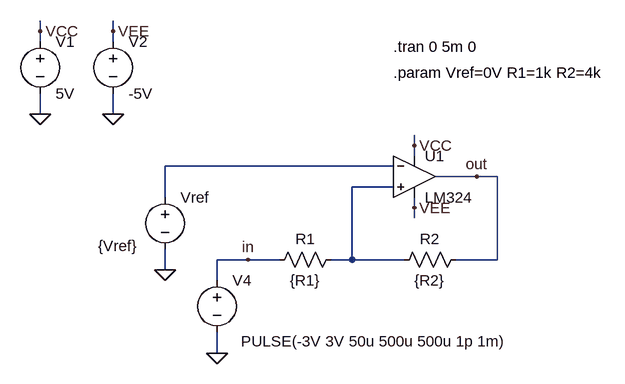
[diagram p0: schematic trigger-Schmitt-neinv.asc]
trigger-Schmitt-neinv.asc, the LTspice schematic file:
Version 4
SHEET 1 880 680
WIRE -704 -336 -704 -352
WIRE -592 -336 -592 -352
WIRE -704 -320 -704 -336
WIRE -592 -320 -592 -336
WIRE -704 -208 -704 -240
WIRE -592 -208 -592 -240
WIRE -128 -160 -128 -176
WIRE -128 -144 -128 -160
WIRE -160 -128 -512 -128
WIRE -32 -112 -96 -112
WIRE 0 -112 -32 -112
WIRE -160 -96 -224 -96
WIRE -512 -80 -512 -128
WIRE -128 -64 -128 -80
WIRE -128 -48 -128 -64
WIRE -384 16 -432 16
WIRE -336 16 -384 16
WIRE -224 16 -224 -96
WIRE -224 16 -256 16
WIRE -144 16 -224 16
WIRE 0 16 0 -112
WIRE 0 16 -64 16
WIRE -512 32 -512 0
WIRE -432 48 -432 16
WIRE -432 160 -432 128
FLAG -704 -208 0
FLAG -592 -208 0
FLAG -128 -160 VCC
FLAG -704 -336 VCC
FLAG -128 -64 VEE
FLAG -592 -336 VEE
FLAG -512 32 0
FLAG -432 160 0
FLAG -32 -112 out
FLAG -384 16 in
SYMBOL res -240 0 R90
WINDOW 0 0 56 VBottom 2
WINDOW 3 32 56 VTop 2
SYMATTR InstName R1
SYMATTR Value {R1}
SYMBOL res -48 0 R90
WINDOW 0 0 56 VBottom 2
WINDOW 3 32 56 VTop 2
SYMATTR InstName R2
SYMATTR Value {R2}
SYMBOL voltage -704 -336 R0
WINDOW 123 0 0 Left 2
WINDOW 39 0 0 Left 2
SYMATTR InstName V1
SYMATTR Value 5V
SYMBOL voltage -592 -336 R0
WINDOW 123 0 0 Left 2
WINDOW 39 0 0 Left 2
SYMATTR InstName V2
SYMATTR Value -5V
SYMBOL voltage -512 -96 R0
WINDOW 3 -103 91 Left 2
SYMATTR Value {Vref}
SYMATTR InstName Vref
SYMBOL voltage -432 32 R0
WINDOW 123 0 0 Left 2
WINDOW 39 0 0 Left 2
WINDOW 3 37 110 Left 2
SYMATTR Value PULSE(-3V 3V 50u 500u 500u 1p 1m)
SYMATTR InstName V4
SYMBOL LM324 -128 -176 R0
SYMATTR InstName U1
TEXT -160 -312 Left 2 !.tran 0 5m 0
TEXT -160 -272 Left 2 !.param Vref=0V R1=1k R2=4k

The netlist it stands for:
* trigger-Schmitt-neinv.asc
R1 N002 in {R1}
R2 out N002 {R2}
V1 VCC 0 5V
V2 VEE 0 -5V
Vref N001 0 {Vref}
V4 in 0 PULSE(-3V 3V 50u 500u 500u 1p 1m)
* U1: LM324 (symbol LM324 not available, pins judged from their places): In+=N002 In-=N001 V+=VCC V-=VEE OUT=out
.tran 0 5m 0
.param Vref=0V R1=1k R2=4k
.backanno
.end